# EAGLE schematic 32pins (EAGLE 6.6.0)

## Sheet 1 of 4
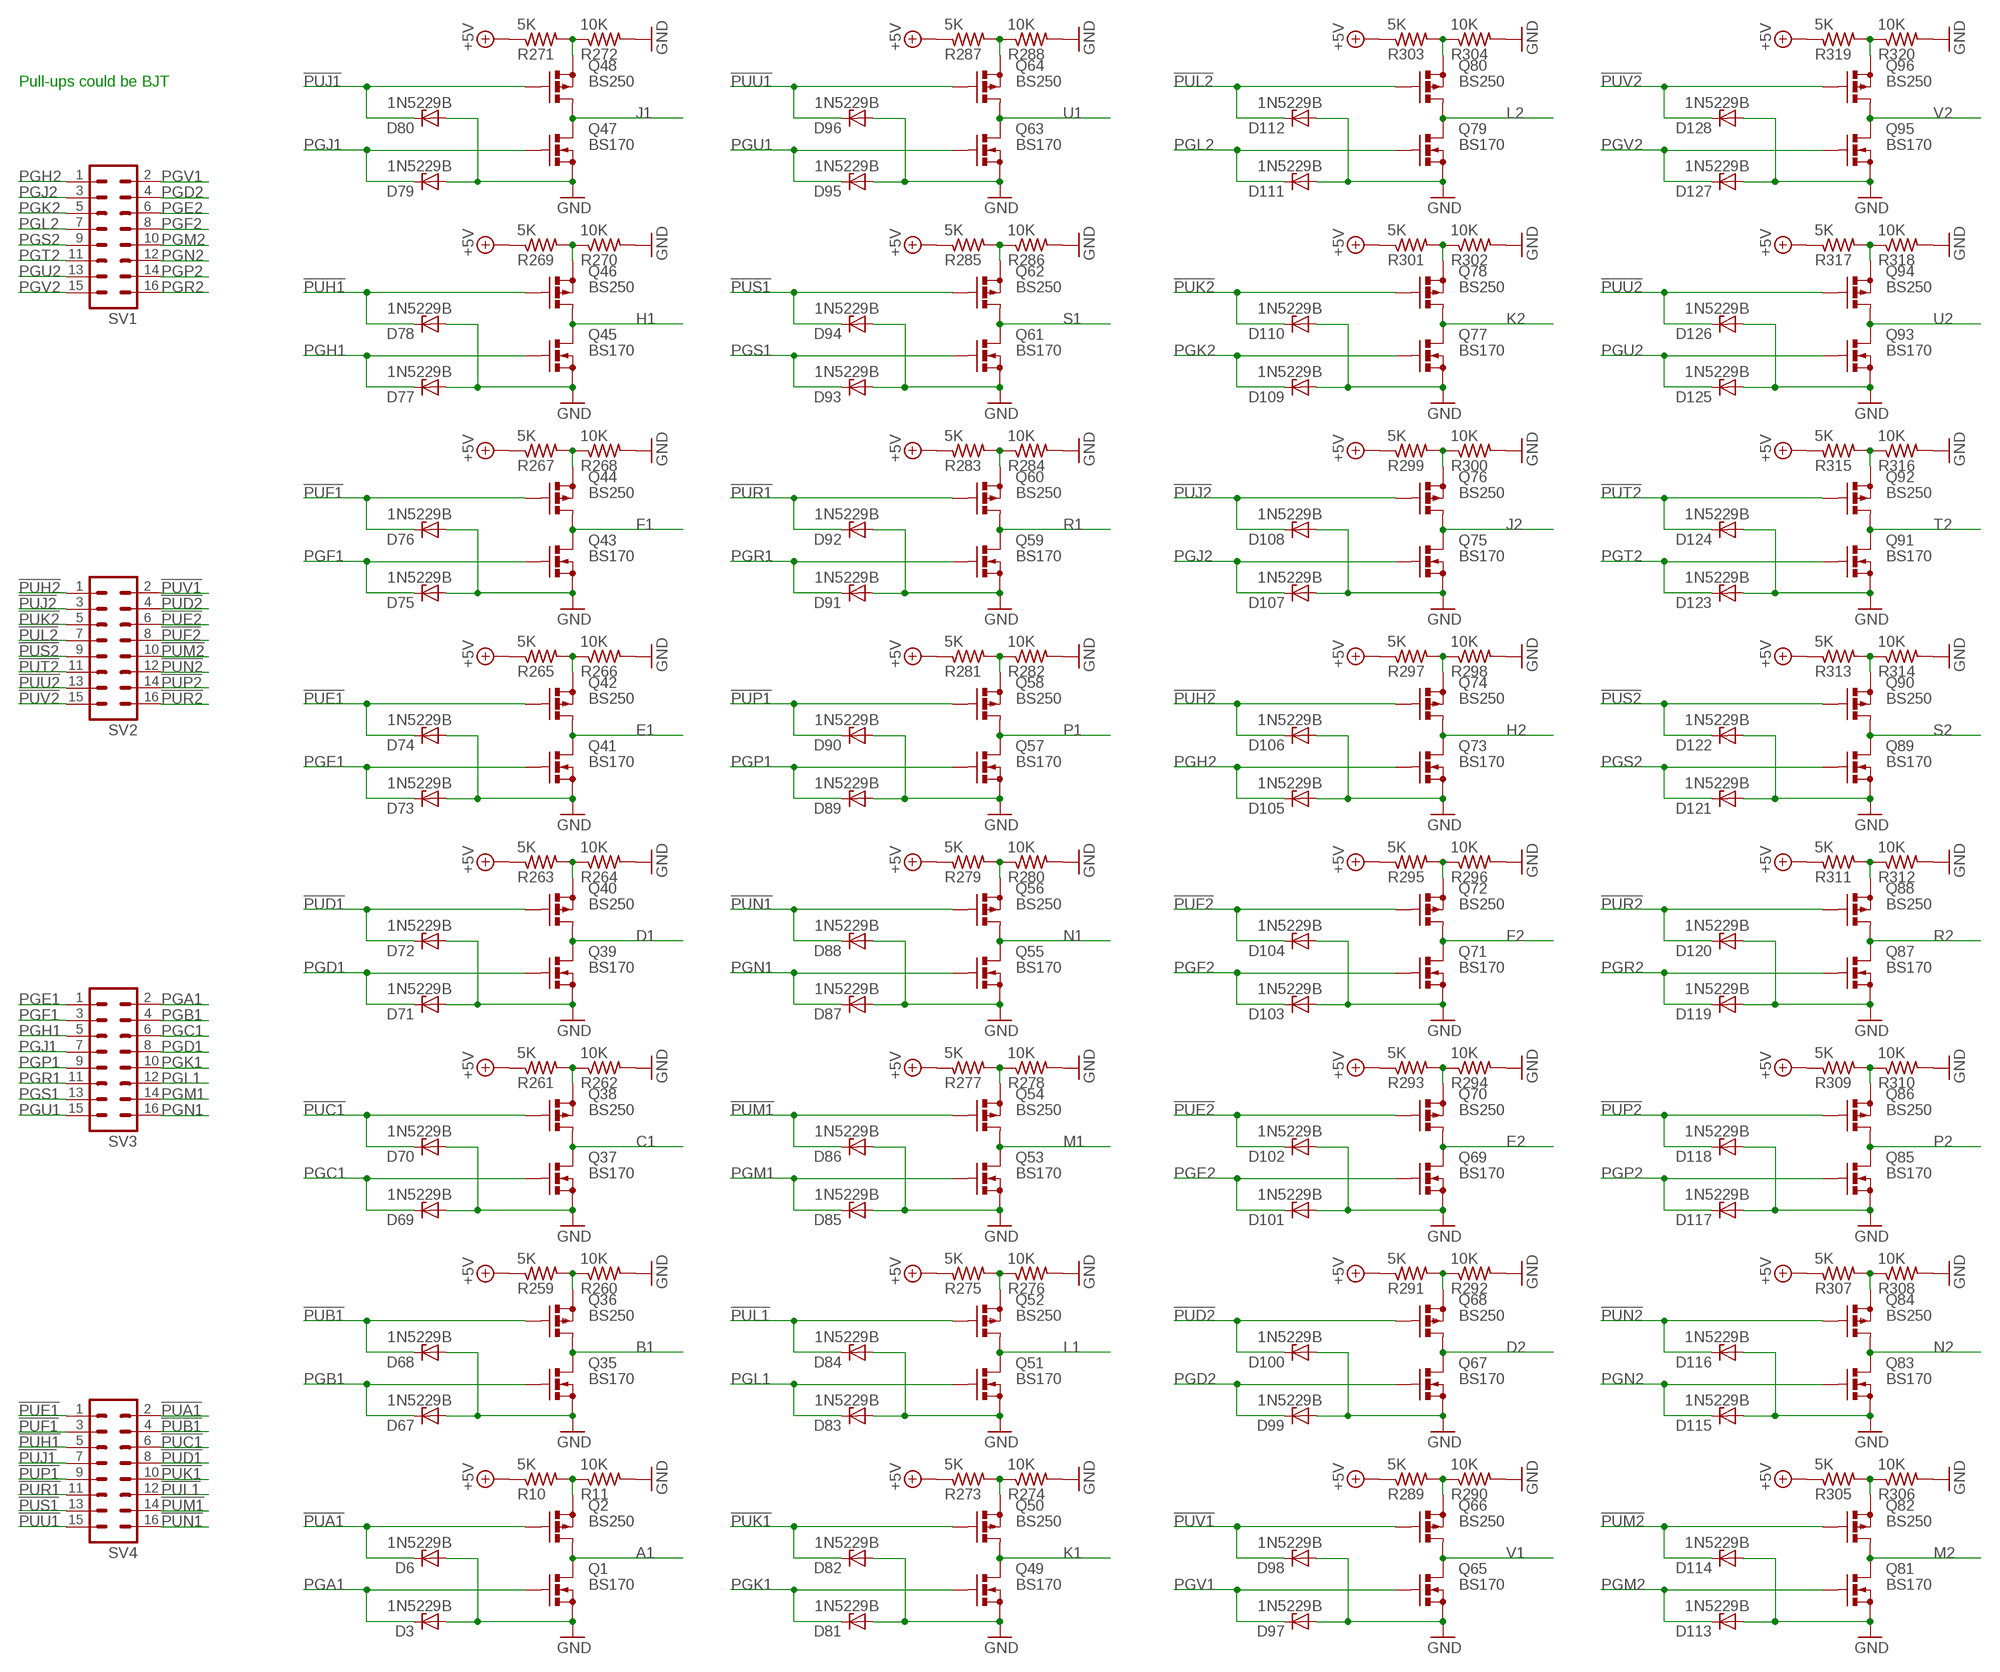
[diagram p0: schematic, sheet 1]

### Parts
D3  1N5229B  ZENER-DIODEZD-2.5  [ZDIO-2.5]
D6  1N5229B  ZENER-DIODEZD-2.5  [ZDIO-2.5]
D67  1N5229B  ZENER-DIODEZD-2.5  [ZDIO-2.5]
D68  1N5229B  ZENER-DIODEZD-2.5  [ZDIO-2.5]
D69  1N5229B  ZENER-DIODEZD-2.5  [ZDIO-2.5]
D70  1N5229B  ZENER-DIODEZD-2.5  [ZDIO-2.5]
D71  1N5229B  ZENER-DIODEZD-2.5  [ZDIO-2.5]
D72  1N5229B  ZENER-DIODEZD-2.5  [ZDIO-2.5]
D73  1N5229B  ZENER-DIODEZD-2.5  [ZDIO-2.5]
D74  1N5229B  ZENER-DIODEZD-2.5  [ZDIO-2.5]
D75  1N5229B  ZENER-DIODEZD-2.5  [ZDIO-2.5]
D76  1N5229B  ZENER-DIODEZD-2.5  [ZDIO-2.5]
D77  1N5229B  ZENER-DIODEZD-2.5  [ZDIO-2.5]
D78  1N5229B  ZENER-DIODEZD-2.5  [ZDIO-2.5]
D79  1N5229B  ZENER-DIODEZD-2.5  [ZDIO-2.5]
D80  1N5229B  ZENER-DIODEZD-2.5  [ZDIO-2.5]
D81  1N5229B  ZENER-DIODEZD-2.5  [ZDIO-2.5]
D82  1N5229B  ZENER-DIODEZD-2.5  [ZDIO-2.5]
D83  1N5229B  ZENER-DIODEZD-2.5  [ZDIO-2.5]
D84  1N5229B  ZENER-DIODEZD-2.5  [ZDIO-2.5]
D85  1N5229B  ZENER-DIODEZD-2.5  [ZDIO-2.5]
D86  1N5229B  ZENER-DIODEZD-2.5  [ZDIO-2.5]
D87  1N5229B  ZENER-DIODEZD-2.5  [ZDIO-2.5]
D88  1N5229B  ZENER-DIODEZD-2.5  [ZDIO-2.5]
D89  1N5229B  ZENER-DIODEZD-2.5  [ZDIO-2.5]
D90  1N5229B  ZENER-DIODEZD-2.5  [ZDIO-2.5]
D91  1N5229B  ZENER-DIODEZD-2.5  [ZDIO-2.5]
D92  1N5229B  ZENER-DIODEZD-2.5  [ZDIO-2.5]
D93  1N5229B  ZENER-DIODEZD-2.5  [ZDIO-2.5]
D94  1N5229B  ZENER-DIODEZD-2.5  [ZDIO-2.5]
D95  1N5229B  ZENER-DIODEZD-2.5  [ZDIO-2.5]
D96  1N5229B  ZENER-DIODEZD-2.5  [ZDIO-2.5]
D97  1N5229B  ZENER-DIODEZD-2.5  [ZDIO-2.5]
D98  1N5229B  ZENER-DIODEZD-2.5  [ZDIO-2.5]
D99  1N5229B  ZENER-DIODEZD-2.5  [ZDIO-2.5]
D100  1N5229B  ZENER-DIODEZD-2.5  [ZDIO-2.5]
D101  1N5229B  ZENER-DIODEZD-2.5  [ZDIO-2.5]
D102  1N5229B  ZENER-DIODEZD-2.5  [ZDIO-2.5]
D103  1N5229B  ZENER-DIODEZD-2.5  [ZDIO-2.5]
D104  1N5229B  ZENER-DIODEZD-2.5  [ZDIO-2.5]
D105  1N5229B  ZENER-DIODEZD-2.5  [ZDIO-2.5]
D106  1N5229B  ZENER-DIODEZD-2.5  [ZDIO-2.5]
D107  1N5229B  ZENER-DIODEZD-2.5  [ZDIO-2.5]
D108  1N5229B  ZENER-DIODEZD-2.5  [ZDIO-2.5]
D109  1N5229B  ZENER-DIODEZD-2.5  [ZDIO-2.5]
D110  1N5229B  ZENER-DIODEZD-2.5  [ZDIO-2.5]
D111  1N5229B  ZENER-DIODEZD-2.5  [ZDIO-2.5]
D112  1N5229B  ZENER-DIODEZD-2.5  [ZDIO-2.5]
D113  1N5229B  ZENER-DIODEZD-2.5  [ZDIO-2.5]
D114  1N5229B  ZENER-DIODEZD-2.5  [ZDIO-2.5]
D115  1N5229B  ZENER-DIODEZD-2.5  [ZDIO-2.5]
D116  1N5229B  ZENER-DIODEZD-2.5  [ZDIO-2.5]
D117  1N5229B  ZENER-DIODEZD-2.5  [ZDIO-2.5]
D118  1N5229B  ZENER-DIODEZD-2.5  [ZDIO-2.5]
D119  1N5229B  ZENER-DIODEZD-2.5  [ZDIO-2.5]
D120  1N5229B  ZENER-DIODEZD-2.5  [ZDIO-2.5]
D121  1N5229B  ZENER-DIODEZD-2.5  [ZDIO-2.5]
D122  1N5229B  ZENER-DIODEZD-2.5  [ZDIO-2.5]
D123  1N5229B  ZENER-DIODEZD-2.5  [ZDIO-2.5]
D124  1N5229B  ZENER-DIODEZD-2.5  [ZDIO-2.5]
D125  1N5229B  ZENER-DIODEZD-2.5  [ZDIO-2.5]
D126  1N5229B  ZENER-DIODEZD-2.5  [ZDIO-2.5]
D127  1N5229B  ZENER-DIODEZD-2.5  [ZDIO-2.5]
D128  1N5229B  ZENER-DIODEZD-2.5  [ZDIO-2.5]
Q1  BS170  [SOT54E]
Q2  BS250  [SOT54E]
Q35  BS170  [SOT54E]
Q36  BS250  [SOT54E]
Q37  BS170  [SOT54E]
Q38  BS250  [SOT54E]
Q39  BS170  [SOT54E]
Q40  BS250  [SOT54E]
Q41  BS170  [SOT54E]
Q42  BS250  [SOT54E]
Q43  BS170  [SOT54E]
Q44  BS250  [SOT54E]
Q45  BS170  [SOT54E]
Q46  BS250  [SOT54E]
Q47  BS170  [SOT54E]
Q48  BS250  [SOT54E]
Q49  BS170  [SOT54E]
Q50  BS250  [SOT54E]
Q51  BS170  [SOT54E]
Q52  BS250  [SOT54E]
Q53  BS170  [SOT54E]
Q54  BS250  [SOT54E]
Q55  BS170  [SOT54E]
Q56  BS250  [SOT54E]
Q57  BS170  [SOT54E]
Q58  BS250  [SOT54E]
Q59  BS170  [SOT54E]
Q60  BS250  [SOT54E]
Q61  BS170  [SOT54E]
Q62  BS250  [SOT54E]
Q63  BS170  [SOT54E]
Q64  BS250  [SOT54E]
Q65  BS170  [SOT54E]
Q66  BS250  [SOT54E]
Q67  BS170  [SOT54E]
Q68  BS250  [SOT54E]
Q69  BS170  [SOT54E]
Q70  BS250  [SOT54E]
Q71  BS170  [SOT54E]
Q72  BS250  [SOT54E]
Q73  BS170  [SOT54E]
Q74  BS250  [SOT54E]
Q75  BS170  [SOT54E]
Q76  BS250  [SOT54E]
Q77  BS170  [SOT54E]
Q78  BS250  [SOT54E]
Q79  BS170  [SOT54E]
Q80  BS250  [SOT54E]
Q81  BS170  [SOT54E]
Q82  BS250  [SOT54E]
Q83  BS170  [SOT54E]
Q84  BS250  [SOT54E]
Q85  BS170  [SOT54E]
Q86  BS250  [SOT54E]
Q87  BS170  [SOT54E]
Q88  BS250  [SOT54E]
Q89  BS170  [SOT54E]
Q90  BS250  [SOT54E]
Q91  BS170  [SOT54E]
Q92  BS250  [SOT54E]
Q93  BS170  [SOT54E]
Q94  BS250  [SOT54E]
Q95  BS170  [SOT54E]
Q96  BS250  [SOT54E]
R10  5K  R-US_0207/2V  [0207/2V]
R11  10K  R-US_0207/2V  [0207/2V]
R259  5K  R-US_0207/2V  [0207/2V]
R260  10K  R-US_0207/2V  [0207/2V]
R261  5K  R-US_0207/2V  [0207/2V]
R262  10K  R-US_0207/2V  [0207/2V]
R263  5K  R-US_0207/2V  [0207/2V]
R264  10K  R-US_0207/2V  [0207/2V]
R265  5K  R-US_0207/2V  [0207/2V]
R266  10K  R-US_0207/2V  [0207/2V]
R267  5K  R-US_0207/2V  [0207/2V]
R268  10K  R-US_0207/2V  [0207/2V]
R269  5K  R-US_0207/2V  [0207/2V]
R270  10K  R-US_0207/2V  [0207/2V]
R271  5K  R-US_0207/2V  [0207/2V]
R272  10K  R-US_0207/2V  [0207/2V]
R273  5K  R-US_0207/2V  [0207/2V]
R274  10K  R-US_0207/2V  [0207/2V]
R275  5K  R-US_0207/2V  [0207/2V]
R276  10K  R-US_0207/2V  [0207/2V]
R277  5K  R-US_0207/2V  [0207/2V]
R278  10K  R-US_0207/2V  [0207/2V]
R279  5K  R-US_0207/2V  [0207/2V]
R280  10K  R-US_0207/2V  [0207/2V]
R281  5K  R-US_0207/2V  [0207/2V]
R282  10K  R-US_0207/2V  [0207/2V]
R283  5K  R-US_0207/2V  [0207/2V]
R284  10K  R-US_0207/2V  [0207/2V]
R285  5K  R-US_0207/2V  [0207/2V]
R286  10K  R-US_0207/2V  [0207/2V]
R287  5K  R-US_0207/2V  [0207/2V]
R288  10K  R-US_0207/2V  [0207/2V]
R289  5K  R-US_0207/2V  [0207/2V]
R290  10K  R-US_0207/2V  [0207/2V]
R291  5K  R-US_0207/2V  [0207/2V]
R292  10K  R-US_0207/2V  [0207/2V]
R293  5K  R-US_0207/2V  [0207/2V]
R294  10K  R-US_0207/2V  [0207/2V]
R295  5K  R-US_0207/2V  [0207/2V]
R296  10K  R-US_0207/2V  [0207/2V]
R297  5K  R-US_0207/2V  [0207/2V]
R298  10K  R-US_0207/2V  [0207/2V]
R299  5K  R-US_0207/2V  [0207/2V]
R300  10K  R-US_0207/2V  [0207/2V]
R301  5K  R-US_0207/2V  [0207/2V]
R302  10K  R-US_0207/2V  [0207/2V]
R303  5K  R-US_0207/2V  [0207/2V]
R304  10K  R-US_0207/2V  [0207/2V]
R305  5K  R-US_0207/2V  [0207/2V]
R306  10K  R-US_0207/2V  [0207/2V]
R307  5K  R-US_0207/2V  [0207/2V]
R308  10K  R-US_0207/2V  [0207/2V]
R309  5K  R-US_0207/2V  [0207/2V]
R310  10K  R-US_0207/2V  [0207/2V]
R311  5K  R-US_0207/2V  [0207/2V]
R312  10K  R-US_0207/2V  [0207/2V]
R313  5K  R-US_0207/2V  [0207/2V]
R314  10K  R-US_0207/2V  [0207/2V]
R315  5K  R-US_0207/2V  [0207/2V]
R316  10K  R-US_0207/2V  [0207/2V]
R317  5K  R-US_0207/2V  [0207/2V]
R318  10K  R-US_0207/2V  [0207/2V]
R319  5K  R-US_0207/2V  [0207/2V]
R320  10K  R-US_0207/2V  [0207/2V]
SV1  MA08-2  [MA08-2]
SV2  MA08-2  [MA08-2]
SV3  MA08-2  [MA08-2]
SV4  MA08-2  [MA08-2]

### Nets
!PUA1: D6.C Q2.G SV4.2
!PUB1: D68.C Q36.G SV4.4
!PUC1: D70.C Q38.G SV4.6
!PUD1: D72.C Q40.G SV4.8
!PUD2: D100.C Q68.G SV2.4
!PUE1: D74.C Q42.G SV4.1
!PUE2: D102.C Q70.G SV2.6
!PUF1: D76.C Q44.G SV4.3
!PUF2: D104.C Q72.G SV2.8
!PUH1: D78.C Q46.G SV4.5
!PUH2: D106.C Q74.G SV2.1
!PUJ1: D80.C Q48.G SV4.7
!PUJ2: D108.C Q76.G SV2.3
!PUK1: D82.C Q50.G SV4.10
!PUK2: D110.C Q78.G SV2.5
!PUL1: D84.C Q52.G SV4.12
!PUL2: D112.C Q80.G SV2.7
!PUM1: D86.C Q54.G SV4.14
!PUM2: D114.C Q82.G SV2.10
!PUN1: D88.C Q56.G SV4.16
!PUN2: D116.C Q84.G SV2.12
!PUP1: D90.C Q58.G SV4.9
!PUP2: D118.C Q86.G SV2.14
!PUR1: D92.C Q60.G SV4.11
!PUR2: D120.C Q88.G SV2.16
!PUS1: D94.C Q62.G SV4.13
!PUS2: D122.C Q90.G SV2.9
!PUT2: D124.C Q92.G SV2.11
!PUU1: D96.C Q64.G SV4.15
!PUU2: D126.C Q94.G SV2.13
!PUV1: D98.C Q66.G SV2.2
!PUV2: D128.C Q96.G SV2.15
+5V: R10.1 R259.1 R261.1 R263.1 R265.1 R267.1 R269.1 R271.1 R273.1 R275.1 R277.1 R279.1 R281.1 R283.1 R285.1 R287.1 R289.1 R291.1 R293.1 R295.1 R297.1 R299.1 R301.1 R303.1 R305.1 R307.1 R309.1 R311.1 R313.1 R315.1 R317.1 R319.1 ; also sheet 4
A1: Q1.D Q2.D ; also sheet 2,3,4
B1: Q35.D Q36.D ; also sheet 2,3,4
C1: Q37.D Q38.D ; also sheet 2,3,4
D1: Q39.D Q40.D ; also sheet 2,3,4
D2: Q67.D Q68.D ; also sheet 2,3,4
E1: Q41.D Q42.D ; also sheet 2,3,4
E2: Q69.D Q70.D ; also sheet 2,3,4
F1: Q43.D Q44.D ; also sheet 2,3,4
F2: Q71.D Q72.D ; also sheet 2,3,4
GND: D3.A D6.A D67.A D68.A D69.A D70.A D71.A D72.A D73.A D74.A D75.A D76.A D77.A D78.A D79.A D80.A D81.A D82.A D83.A D84.A D85.A D86.A D87.A D88.A D89.A D90.A D91.A D92.A D93.A D94.A D95.A D96.A D97.A D98.A D99.A D100.A D101.A D102.A D103.A D104.A D105.A D106.A D107.A D108.A D109.A D110.A D111.A D112.A D113.A D114.A D115.A D116.A D117.A D118.A D119.A D120.A D121.A D122.A D123.A D124.A D125.A D126.A D127.A D128.A Q1.S Q35.S Q37.S Q39.S Q41.S Q43.S Q45.S Q47.S Q49.S Q51.S Q53.S Q55.S Q57.S Q59.S Q61.S Q63.S Q65.S Q67.S Q69.S Q71.S Q73.S Q75.S Q77.S Q79.S Q81.S Q83.S Q85.S Q87.S Q89.S Q91.S Q93.S Q95.S R11.2 R260.2 R262.2 R264.2 R266.2 R268.2 R270.2 R272.2 R274.2 R276.2 R278.2 R280.2 R282.2 R284.2 R286.2 R288.2 R290.2 R292.2 R294.2 R296.2 R298.2 R300.2 R302.2 R304.2 R306.2 R308.2 R310.2 R312.2 R314.2 R316.2 R318.2 R320.2 ; also sheet 2,3,4
H1: Q45.D Q46.D ; also sheet 2,3,4
H2: Q73.D Q74.D ; also sheet 2,3,4
J1: Q47.D Q48.D ; also sheet 2,3,4
J2: Q75.D Q76.D ; also sheet 2,3,4
K1: Q49.D Q50.D ; also sheet 2,3,4
K2: Q77.D Q78.D ; also sheet 2,3,4
L1: Q51.D Q52.D ; also sheet 2,3,4
L2: Q79.D Q80.D ; also sheet 2,3,4
M1: Q53.D Q54.D ; also sheet 2,3,4
M2: Q81.D Q82.D ; also sheet 2,3,4
N1: Q55.D Q56.D ; also sheet 2,3,4
N2: Q83.D Q84.D ; also sheet 2,3,4
N$5: Q2.S R10.2 R11.1
N$294: Q36.S R259.2 R260.1
N$298: Q38.S R261.2 R262.1
N$302: Q40.S R263.2 R264.1
N$306: Q42.S R265.2 R266.1
N$310: Q44.S R267.2 R268.1
N$314: Q46.S R269.2 R270.1
N$318: Q48.S R271.2 R272.1
N$322: Q50.S R273.2 R274.1
N$326: Q52.S R275.2 R276.1
N$330: Q54.S R277.2 R278.1
N$334: Q56.S R279.2 R280.1
N$338: Q58.S R281.2 R282.1
N$342: Q60.S R283.2 R284.1
N$346: Q62.S R285.2 R286.1
N$350: Q64.S R287.2 R288.1
N$354: Q66.S R289.2 R290.1
N$358: Q68.S R291.2 R292.1
N$362: Q70.S R293.2 R294.1
N$366: Q72.S R295.2 R296.1
N$370: Q74.S R297.2 R298.1
N$374: Q76.S R299.2 R300.1
N$378: Q78.S R301.2 R302.1
N$382: Q80.S R303.2 R304.1
N$386: Q82.S R305.2 R306.1
N$390: Q84.S R307.2 R308.1
N$394: Q86.S R309.2 R310.1
N$398: Q88.S R311.2 R312.1
N$402: Q90.S R313.2 R314.1
N$406: Q92.S R315.2 R316.1
N$410: Q94.S R317.2 R318.1
N$414: Q96.S R319.2 R320.1
P1: Q57.D Q58.D ; also sheet 2,3,4
P2: Q85.D Q86.D ; also sheet 2,3,4
PGA1: D3.C Q1.G SV3.2
PGB1: D67.C Q35.G SV3.4
PGC1: D69.C Q37.G SV3.6
PGD1: D71.C Q39.G SV3.8
PGD2: D99.C Q67.G SV1.4
PGE1: D73.C Q41.G SV3.1
PGE2: D101.C Q69.G SV1.6
PGF1: D75.C Q43.G SV3.3
PGF2: D103.C Q71.G SV1.8
PGH1: D77.C Q45.G SV3.5
PGH2: D105.C Q73.G SV1.1
PGJ1: D79.C Q47.G SV3.7
PGJ2: D107.C Q75.G SV1.3
PGK1: D81.C Q49.G SV3.10
PGK2: D109.C Q77.G SV1.5
PGL1: D83.C Q51.G SV3.12
PGL2: D111.C Q79.G SV1.7
PGM1: D85.C Q53.G SV3.14
PGM2: D113.C Q81.G SV1.10
PGN1: D87.C Q55.G SV3.16
PGN2: D115.C Q83.G SV1.12
PGP1: D89.C Q57.G SV3.9
PGP2: D117.C Q85.G SV1.14
PGR1: D91.C Q59.G SV3.11
PGR2: D119.C Q87.G SV1.16
PGS1: D93.C Q61.G SV3.13
PGS2: D121.C Q89.G SV1.9
PGT2: D123.C Q91.G SV1.11
PGU1: D95.C Q63.G SV3.15
PGU2: D125.C Q93.G SV1.13
PGV1: D97.C Q65.G SV1.2
PGV2: D127.C Q95.G SV1.15
R1: Q59.D Q60.D ; also sheet 2,3,4
R2: Q87.D Q88.D ; also sheet 2,3,4
S1: Q61.D Q62.D ; also sheet 2,3,4
S2: Q89.D Q90.D ; also sheet 2,3,4
T2: Q91.D Q92.D ; also sheet 2,3,4
U1: Q63.D Q64.D ; also sheet 2,3,4
U2: Q93.D Q94.D ; also sheet 2,3,4
V1: Q65.D Q66.D ; also sheet 2,3,4
V2: Q95.D Q96.D ; also sheet 2,3,4

### Notes on the sheet
- Pull-ups could be BJT

## Sheet 2 of 4
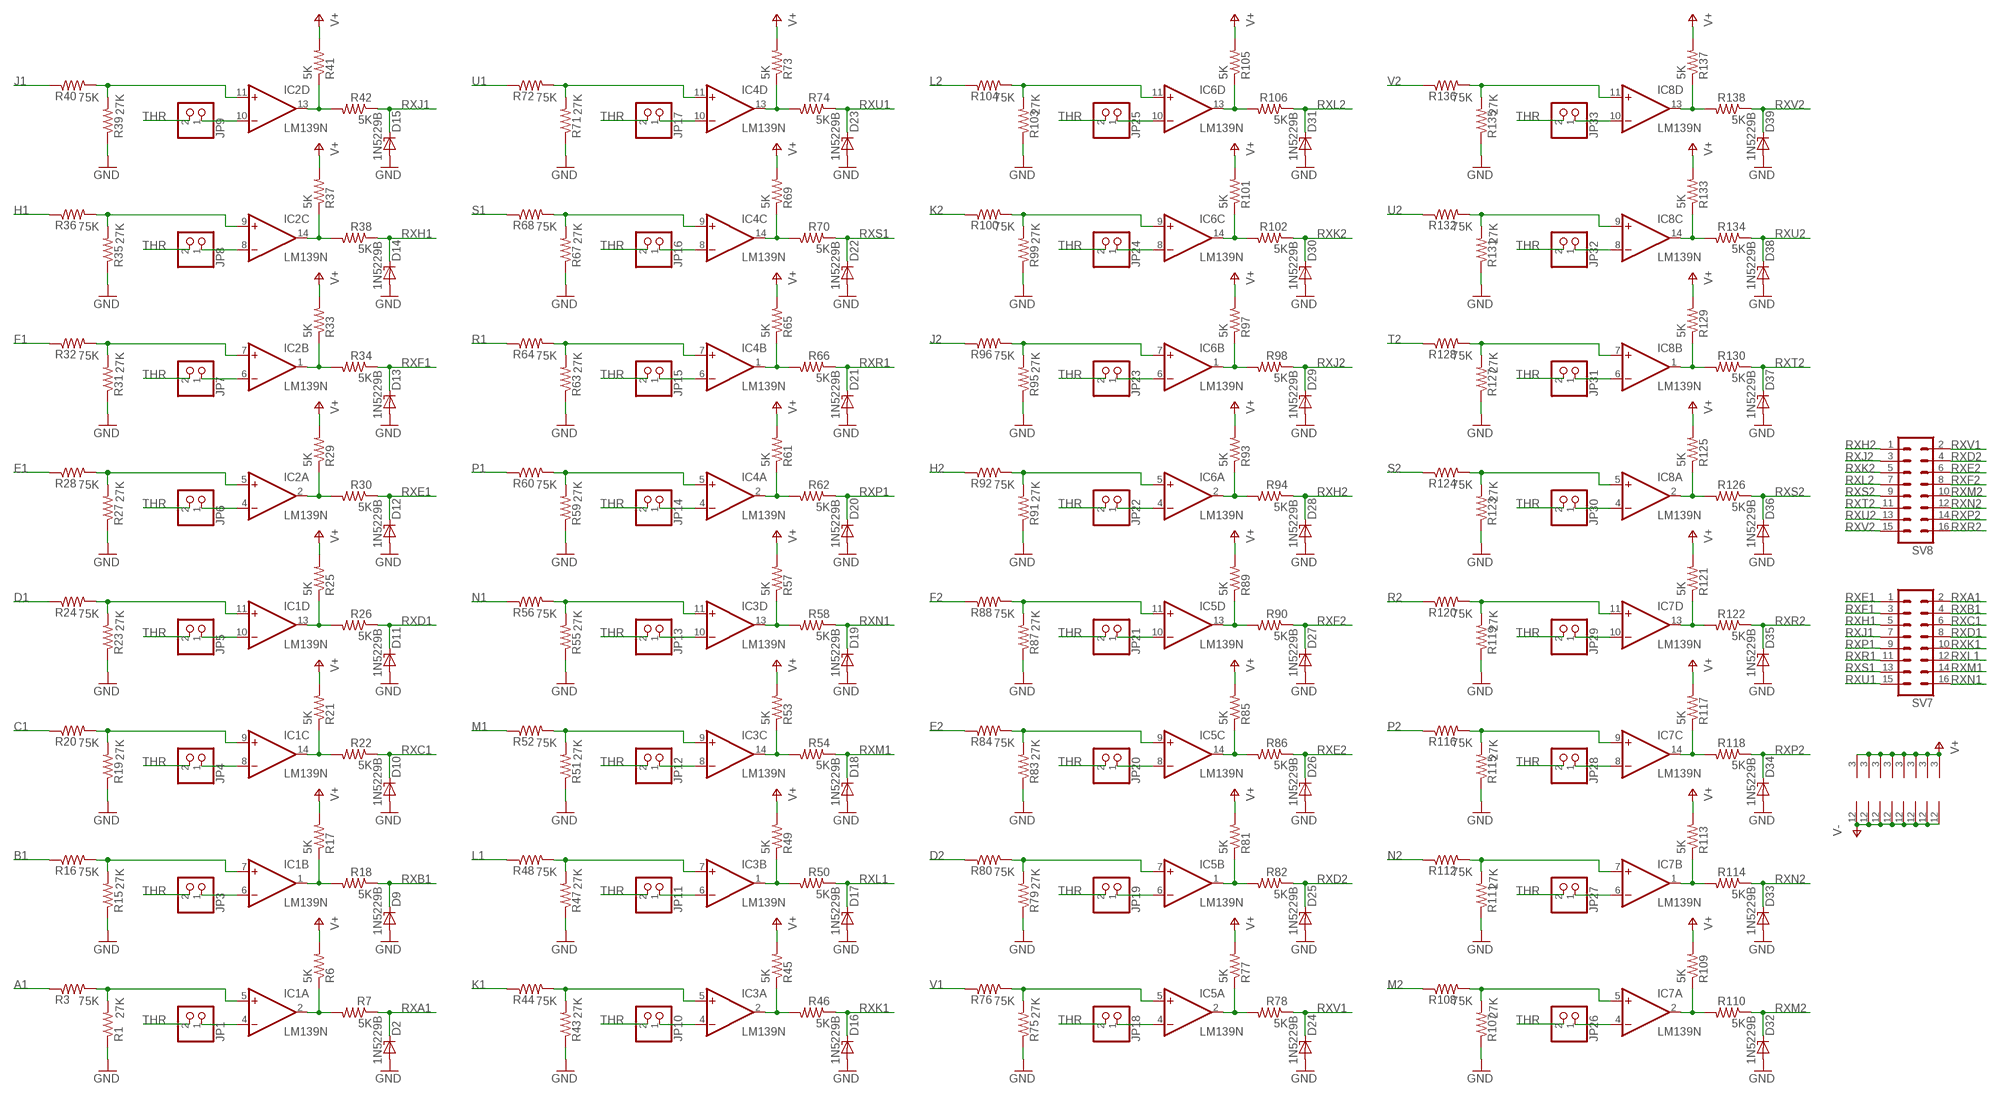
[diagram p1: schematic, sheet 2]

### Parts
D2  1N5229B  ZENER-DIODEZD-2.5  [ZDIO-2.5]
D9  1N5229B  ZENER-DIODEZD-2.5  [ZDIO-2.5]
D10  1N5229B  ZENER-DIODEZD-2.5  [ZDIO-2.5]
D11  1N5229B  ZENER-DIODEZD-2.5  [ZDIO-2.5]
D12  1N5229B  ZENER-DIODEZD-2.5  [ZDIO-2.5]
D13  1N5229B  ZENER-DIODEZD-2.5  [ZDIO-2.5]
D14  1N5229B  ZENER-DIODEZD-2.5  [ZDIO-2.5]
D15  1N5229B  ZENER-DIODEZD-2.5  [ZDIO-2.5]
D16  1N5229B  ZENER-DIODEZD-2.5  [ZDIO-2.5]
D17  1N5229B  ZENER-DIODEZD-2.5  [ZDIO-2.5]
D18  1N5229B  ZENER-DIODEZD-2.5  [ZDIO-2.5]
D19  1N5229B  ZENER-DIODEZD-2.5  [ZDIO-2.5]
D20  1N5229B  ZENER-DIODEZD-2.5  [ZDIO-2.5]
D21  1N5229B  ZENER-DIODEZD-2.5  [ZDIO-2.5]
D22  1N5229B  ZENER-DIODEZD-2.5  [ZDIO-2.5]
D23  1N5229B  ZENER-DIODEZD-2.5  [ZDIO-2.5]
D24  1N5229B  ZENER-DIODEZD-2.5  [ZDIO-2.5]
D25  1N5229B  ZENER-DIODEZD-2.5  [ZDIO-2.5]
D26  1N5229B  ZENER-DIODEZD-2.5  [ZDIO-2.5]
D27  1N5229B  ZENER-DIODEZD-2.5  [ZDIO-2.5]
D28  1N5229B  ZENER-DIODEZD-2.5  [ZDIO-2.5]
D29  1N5229B  ZENER-DIODEZD-2.5  [ZDIO-2.5]
D30  1N5229B  ZENER-DIODEZD-2.5  [ZDIO-2.5]
D31  1N5229B  ZENER-DIODEZD-2.5  [ZDIO-2.5]
D32  1N5229B  ZENER-DIODEZD-2.5  [ZDIO-2.5]
D33  1N5229B  ZENER-DIODEZD-2.5  [ZDIO-2.5]
D34  1N5229B  ZENER-DIODEZD-2.5  [ZDIO-2.5]
D35  1N5229B  ZENER-DIODEZD-2.5  [ZDIO-2.5]
D36  1N5229B  ZENER-DIODEZD-2.5  [ZDIO-2.5]
D37  1N5229B  ZENER-DIODEZD-2.5  [ZDIO-2.5]
D38  1N5229B  ZENER-DIODEZD-2.5  [ZDIO-2.5]
D39  1N5229B  ZENER-DIODEZD-2.5  [ZDIO-2.5]
IC1  LM139N  LM339N  [DIL14]
IC2  LM139N  LM339N  [DIL14]
IC3  LM139N  LM339N  [DIL14]
IC4  LM139N  LM339N  [DIL14]
IC5  LM139N  LM339N  [DIL14]
IC6  LM139N  LM339N  [DIL14]
IC7  LM139N  LM339N  [DIL14]
IC8  LM139N  LM339N  [DIL14]
JP1  PINHD-1X2  [1X02]
JP3  PINHD-1X2  [1X02]
JP4  PINHD-1X2  [1X02]
JP5  PINHD-1X2  [1X02]
JP6  PINHD-1X2  [1X02]
JP7  PINHD-1X2  [1X02]
JP8  PINHD-1X2  [1X02]
JP9  PINHD-1X2  [1X02]
JP10  PINHD-1X2  [1X02]
JP11  PINHD-1X2  [1X02]
JP12  PINHD-1X2  [1X02]
JP13  PINHD-1X2  [1X02]
JP14  PINHD-1X2  [1X02]
JP15  PINHD-1X2  [1X02]
JP16  PINHD-1X2  [1X02]
JP17  PINHD-1X2  [1X02]
JP18  PINHD-1X2  [1X02]
JP19  PINHD-1X2  [1X02]
JP20  PINHD-1X2  [1X02]
JP21  PINHD-1X2  [1X02]
JP22  PINHD-1X2  [1X02]
JP23  PINHD-1X2  [1X02]
JP24  PINHD-1X2  [1X02]
JP25  PINHD-1X2  [1X02]
JP26  PINHD-1X2  [1X02]
JP27  PINHD-1X2  [1X02]
JP28  PINHD-1X2  [1X02]
JP29  PINHD-1X2  [1X02]
JP30  PINHD-1X2  [1X02]
JP31  PINHD-1X2  [1X02]
JP32  PINHD-1X2  [1X02]
JP33  PINHD-1X2  [1X02]
R1  27K  R-US_0207/2V  [0207/2V]
R3  75K  R-US_0207/2V  [0207/2V]
R6  5K  R-US_0207/2V  [0207/2V]
R7  5K  R-US_0207/2V  [0207/2V]
R15  27K  R-US_0207/2V  [0207/2V]
R16  75K  R-US_0207/2V  [0207/2V]
R17  5K  R-US_0207/2V  [0207/2V]
R18  5K  R-US_0207/2V  [0207/2V]
R19  27K  R-US_0207/2V  [0207/2V]
R20  75K  R-US_0207/2V  [0207/2V]
R21  5K  R-US_0207/2V  [0207/2V]
R22  5K  R-US_0207/2V  [0207/2V]
R23  27K  R-US_0207/2V  [0207/2V]
R24  75K  R-US_0207/2V  [0207/2V]
R25  5K  R-US_0207/2V  [0207/2V]
R26  5K  R-US_0207/2V  [0207/2V]
R27  27K  R-US_0207/2V  [0207/2V]
R28  75K  R-US_0207/2V  [0207/2V]
R29  5K  R-US_0207/2V  [0207/2V]
R30  5K  R-US_0207/2V  [0207/2V]
R31  27K  R-US_0207/2V  [0207/2V]
R32  75K  R-US_0207/2V  [0207/2V]
R33  5K  R-US_0207/2V  [0207/2V]
R34  5K  R-US_0207/2V  [0207/2V]
R35  27K  R-US_0207/2V  [0207/2V]
R36  75K  R-US_0207/2V  [0207/2V]
R37  5K  R-US_0207/2V  [0207/2V]
R38  5K  R-US_0207/2V  [0207/2V]
R39  27K  R-US_0207/2V  [0207/2V]
R40  75K  R-US_0207/2V  [0207/2V]
R41  5K  R-US_0207/2V  [0207/2V]
R42  5K  R-US_0207/2V  [0207/2V]
R43  27K  R-US_0207/2V  [0207/2V]
R44  75K  R-US_0207/2V  [0207/2V]
R45  5K  R-US_0207/2V  [0207/2V]
R46  5K  R-US_0207/2V  [0207/2V]
R47  27K  R-US_0207/2V  [0207/2V]
R48  75K  R-US_0207/2V  [0207/2V]
R49  5K  R-US_0207/2V  [0207/2V]
R50  5K  R-US_0207/2V  [0207/2V]
R51  27K  R-US_0207/2V  [0207/2V]
R52  75K  R-US_0207/2V  [0207/2V]
R53  5K  R-US_0207/2V  [0207/2V]
R54  5K  R-US_0207/2V  [0207/2V]
R55  27K  R-US_0207/2V  [0207/2V]
R56  75K  R-US_0207/2V  [0207/2V]
R57  5K  R-US_0207/2V  [0207/2V]
R58  5K  R-US_0207/2V  [0207/2V]
R59  27K  R-US_0207/2V  [0207/2V]
R60  75K  R-US_0207/2V  [0207/2V]
R61  5K  R-US_0207/2V  [0207/2V]
R62  5K  R-US_0207/2V  [0207/2V]
R63  27K  R-US_0207/2V  [0207/2V]
R64  75K  R-US_0207/2V  [0207/2V]
R65  5K  R-US_0207/2V  [0207/2V]
R66  5K  R-US_0207/2V  [0207/2V]
R67  27K  R-US_0207/2V  [0207/2V]
R68  75K  R-US_0207/2V  [0207/2V]
R69  5K  R-US_0207/2V  [0207/2V]
R70  5K  R-US_0207/2V  [0207/2V]
R71  27K  R-US_0207/2V  [0207/2V]
R72  75K  R-US_0207/2V  [0207/2V]
R73  5K  R-US_0207/2V  [0207/2V]
R74  5K  R-US_0207/2V  [0207/2V]
R75  27K  R-US_0207/2V  [0207/2V]
R76  75K  R-US_0207/2V  [0207/2V]
R77  5K  R-US_0207/2V  [0207/2V]
R78  5K  R-US_0207/2V  [0207/2V]
R79  27K  R-US_0207/2V  [0207/2V]
R80  75K  R-US_0207/2V  [0207/2V]
R81  5K  R-US_0207/2V  [0207/2V]
R82  5K  R-US_0207/2V  [0207/2V]
R83  27K  R-US_0207/2V  [0207/2V]
R84  75K  R-US_0207/2V  [0207/2V]
R85  5K  R-US_0207/2V  [0207/2V]
R86  5K  R-US_0207/2V  [0207/2V]
R87  27K  R-US_0207/2V  [0207/2V]
R88  75K  R-US_0207/2V  [0207/2V]
R89  5K  R-US_0207/2V  [0207/2V]
R90  5K  R-US_0207/2V  [0207/2V]
R91  27K  R-US_0207/2V  [0207/2V]
R92  75K  R-US_0207/2V  [0207/2V]
R93  5K  R-US_0207/2V  [0207/2V]
R94  5K  R-US_0207/2V  [0207/2V]
R95  27K  R-US_0207/2V  [0207/2V]
R96  75K  R-US_0207/2V  [0207/2V]
R97  5K  R-US_0207/2V  [0207/2V]
R98  5K  R-US_0207/2V  [0207/2V]
R99  27K  R-US_0207/2V  [0207/2V]
R100  75K  R-US_0207/2V  [0207/2V]
R101  5K  R-US_0207/2V  [0207/2V]
R102  5K  R-US_0207/2V  [0207/2V]
R103  27K  R-US_0207/2V  [0207/2V]
R104  75K  R-US_0207/2V  [0207/2V]
R105  5K  R-US_0207/2V  [0207/2V]
R106  5K  R-US_0207/2V  [0207/2V]
R107  27K  R-US_0207/2V  [0207/2V]
R108  75K  R-US_0207/2V  [0207/2V]
R109  5K  R-US_0207/2V  [0207/2V]
R110  5K  R-US_0207/2V  [0207/2V]
R111  27K  R-US_0207/2V  [0207/2V]
R112  75K  R-US_0207/2V  [0207/2V]
R113  5K  R-US_0207/2V  [0207/2V]
R114  5K  R-US_0207/2V  [0207/2V]
R115  27K  R-US_0207/2V  [0207/2V]
R116  75K  R-US_0207/2V  [0207/2V]
R117  5K  R-US_0207/2V  [0207/2V]
R118  5K  R-US_0207/2V  [0207/2V]
R119  27K  R-US_0207/2V  [0207/2V]
R120  75K  R-US_0207/2V  [0207/2V]
R121  5K  R-US_0207/2V  [0207/2V]
R122  5K  R-US_0207/2V  [0207/2V]
R123  27K  R-US_0207/2V  [0207/2V]
R124  75K  R-US_0207/2V  [0207/2V]
R125  5K  R-US_0207/2V  [0207/2V]
R126  5K  R-US_0207/2V  [0207/2V]
R127  27K  R-US_0207/2V  [0207/2V]
R128  75K  R-US_0207/2V  [0207/2V]
R129  5K  R-US_0207/2V  [0207/2V]
R130  5K  R-US_0207/2V  [0207/2V]
R131  27K  R-US_0207/2V  [0207/2V]
R132  75K  R-US_0207/2V  [0207/2V]
R133  5K  R-US_0207/2V  [0207/2V]
R134  5K  R-US_0207/2V  [0207/2V]
R135  27K  R-US_0207/2V  [0207/2V]
R136  75K  R-US_0207/2V  [0207/2V]
R137  5K  R-US_0207/2V  [0207/2V]
R138  5K  R-US_0207/2V  [0207/2V]
SV7  MA08-2  [MA08-2]
SV8  MA08-2  [MA08-2]

### Nets
A1: R3.1 ; also sheet 1,3,4
B1: R16.1 ; also sheet 1,3,4
C1: R20.1 ; also sheet 1,3,4
D1: R24.1 ; also sheet 1,3,4
D2: R80.1 ; also sheet 1,3,4
E1: R28.1 ; also sheet 1,3,4
E2: R84.1 ; also sheet 1,3,4
F1: R32.1 ; also sheet 1,3,4
F2: R88.1 ; also sheet 1,3,4
GND: D2.A D9.A D10.A D11.A D12.A D13.A D14.A D15.A D16.A D17.A D18.A D19.A D20.A D21.A D22.A D23.A D24.A D25.A D26.A D27.A D28.A D29.A D30.A D31.A D32.A D33.A D34.A D35.A D36.A D37.A D38.A D39.A R1.1 R15.1 R19.1 R23.1 R27.1 R31.1 R35.1 R39.1 R43.1 R47.1 R51.1 R55.1 R59.1 R63.1 R67.1 R71.1 R75.1 R79.1 R83.1 R87.1 R91.1 R95.1 R99.1 R103.1 R107.1 R111.1 R115.1 R119.1 R123.1 R127.1 R131.1 R135.1 ; also sheet 1,3,4
H1: R36.1 ; also sheet 1,3,4
H2: R92.1 ; also sheet 1,3,4
J1: R40.1 ; also sheet 1,3,4
J2: R96.1 ; also sheet 1,3,4
K1: R44.1 ; also sheet 1,3,4
K2: R100.1 ; also sheet 1,3,4
L1: R48.1 ; also sheet 1,3,4
L2: R104.1 ; also sheet 1,3,4
M1: R52.1 ; also sheet 1,3,4
M2: R108.1 ; also sheet 1,3,4
N1: R56.1 ; also sheet 1,3,4
N2: R112.1 ; also sheet 1,3,4
N$13: IC1.5(A:+IN) R1.2 R3.2
N$14: IC1.4(A:-IN) JP1.1
N$18: IC1.2(A:OUT) R6.1 R7.2
N$20: IC1.7(B:+IN) R15.2 R16.2
N$21: IC1.6(B:-IN) JP3.1
N$22: IC1.1(B:OUT) R17.1 R18.2
N$23: IC1.9(C:+IN) R19.2 R20.2
N$24: IC1.8(C:-IN) JP4.1
N$25: IC1.14(C:OUT) R21.1 R22.2
N$26: IC1.11(D:+IN) R23.2 R24.2
N$27: IC1.10(D:-IN) JP5.1
N$28: IC1.13(D:OUT) R25.1 R26.2
N$35: IC2.5(A:+IN) R27.2 R28.2
N$36: IC2.4(A:-IN) JP6.1
N$38: IC2.2(A:OUT) R29.1 R30.2
N$39: IC2.7(B:+IN) R31.2 R32.2
N$40: IC2.6(B:-IN) JP7.1
N$41: IC2.1(B:OUT) R33.1 R34.2
N$42: IC2.9(C:+IN) R35.2 R36.2
N$43: IC2.8(C:-IN) JP8.1
N$44: IC2.14(C:OUT) R37.1 R38.2
N$45: IC2.11(D:+IN) R39.2 R40.2
N$46: IC2.10(D:-IN) JP9.1
N$47: IC2.13(D:OUT) R41.1 R42.2
N$55: IC3.5(A:+IN) R43.2 R44.2
N$56: IC3.4(A:-IN) JP10.1
N$58: IC3.2(A:OUT) R45.1 R46.2
N$59: IC3.7(B:+IN) R47.2 R48.2
N$60: IC3.6(B:-IN) JP11.1
N$61: IC3.1(B:OUT) R49.1 R50.2
N$62: IC3.9(C:+IN) R51.2 R52.2
N$63: IC3.8(C:-IN) JP12.1
N$64: IC3.14(C:OUT) R53.1 R54.2
N$65: IC3.11(D:+IN) R55.2 R56.2
N$66: IC3.10(D:-IN) JP13.1
N$67: IC3.13(D:OUT) R57.1 R58.2
N$75: IC4.5(A:+IN) R59.2 R60.2
N$76: IC4.4(A:-IN) JP14.1
N$78: IC4.2(A:OUT) R61.1 R62.2
N$79: IC4.7(B:+IN) R63.2 R64.2
N$80: IC4.6(B:-IN) JP15.1
N$81: IC4.1(B:OUT) R65.1 R66.2
N$82: IC4.9(C:+IN) R67.2 R68.2
N$83: IC4.8(C:-IN) JP16.1
N$84: IC4.14(C:OUT) R69.1 R70.2
N$85: IC4.11(D:+IN) R71.2 R72.2
N$86: IC4.10(D:-IN) JP17.1
N$87: IC4.13(D:OUT) R73.1 R74.2
N$95: IC5.5(A:+IN) R75.2 R76.2
N$96: IC5.4(A:-IN) JP18.1
N$98: IC5.2(A:OUT) R77.1 R78.2
N$99: IC5.7(B:+IN) R79.2 R80.2
N$100: IC5.6(B:-IN) JP19.1
N$101: IC5.1(B:OUT) R81.1 R82.2
N$102: IC5.9(C:+IN) R83.2 R84.2
N$103: IC5.8(C:-IN) JP20.1
N$104: IC5.14(C:OUT) R85.1 R86.2
N$105: IC5.11(D:+IN) R87.2 R88.2
N$106: IC5.10(D:-IN) JP21.1
N$107: IC5.13(D:OUT) R89.1 R90.2
N$115: IC6.5(A:+IN) R91.2 R92.2
N$116: IC6.4(A:-IN) JP22.1
N$118: IC6.2(A:OUT) R93.1 R94.2
N$119: IC6.7(B:+IN) R95.2 R96.2
N$120: IC6.6(B:-IN) JP23.1
N$121: IC6.1(B:OUT) R97.1 R98.2
N$122: IC6.9(C:+IN) R99.2 R100.2
N$123: IC6.8(C:-IN) JP24.1
N$124: IC6.14(C:OUT) R101.1 R102.2
N$125: IC6.11(D:+IN) R103.2 R104.2
N$126: IC6.10(D:-IN) JP25.1
N$127: IC6.13(D:OUT) R105.1 R106.2
N$135: IC7.5(A:+IN) R107.2 R108.2
N$136: IC7.4(A:-IN) JP26.1
N$138: IC7.2(A:OUT) R109.1 R110.2
N$139: IC7.7(B:+IN) R111.2 R112.2
N$140: IC7.6(B:-IN) JP27.1
N$141: IC7.1(B:OUT) R113.1 R114.2
N$142: IC7.9(C:+IN) R115.2 R116.2
N$143: IC7.8(C:-IN) JP28.1
N$144: IC7.14(C:OUT) R117.1 R118.2
N$145: IC7.11(D:+IN) R119.2 R120.2
N$146: IC7.10(D:-IN) JP29.1
N$147: IC7.13(D:OUT) R121.1 R122.2
N$155: IC8.5(A:+IN) R123.2 R124.2
N$156: IC8.4(A:-IN) JP30.1
N$158: IC8.2(A:OUT) R125.1 R126.2
N$159: IC8.7(B:+IN) R127.2 R128.2
N$160: IC8.6(B:-IN) JP31.1
N$161: IC8.1(B:OUT) R129.1 R130.2
N$162: IC8.9(C:+IN) R131.2 R132.2
N$163: IC8.8(C:-IN) JP32.1
N$164: IC8.14(C:OUT) R133.1 R134.2
N$165: IC8.11(D:+IN) R135.2 R136.2
N$166: IC8.10(D:-IN) JP33.1
N$167: IC8.13(D:OUT) R137.1 R138.2
P1: R60.1 ; also sheet 1,3,4
P2: R116.1 ; also sheet 1,3,4
R1: R64.1 ; also sheet 1,3,4
R2: R120.1 ; also sheet 1,3,4
RXA1: D2.C R7.1 SV7.2
RXB1: D9.C R18.1 SV7.4
RXC1: D10.C R22.1 SV7.6
RXD1: D11.C R26.1 SV7.8
RXD2: D25.C R82.1 SV8.4
RXE1: D12.C R30.1 SV7.1
RXE2: D26.C R86.1 SV8.6
RXF1: D13.C R34.1 SV7.3
RXF2: D27.C R90.1 SV8.8
RXH1: D14.C R38.1 SV7.5
RXH2: D28.C R94.1 SV8.1
RXJ1: D15.C R42.1 SV7.7
RXJ2: D29.C R98.1 SV8.3
RXK1: D16.C R46.1 SV7.10
RXK2: D30.C R102.1 SV8.5
RXL1: D17.C R50.1 SV7.12
RXL2: D31.C R106.1 SV8.7
RXM1: D18.C R54.1 SV7.14
RXM2: D32.C R110.1 SV8.10
RXN1: D19.C R58.1 SV7.16
RXN2: D33.C R114.1 SV8.12
RXP1: D20.C R62.1 SV7.9
RXP2: D34.C R118.1 SV8.14
RXR1: D21.C R66.1 SV7.11
RXR2: D35.C R122.1 SV8.16
RXS1: D22.C R70.1 SV7.13
RXS2: D36.C R126.1 SV8.9
RXT2: D37.C R130.1 SV8.11
RXU1: D23.C R74.1 SV7.15
RXU2: D38.C R134.1 SV8.13
RXV1: D24.C R78.1 SV8.2
RXV2: D39.C R138.1 SV8.15
S1: R68.1 ; also sheet 1,3,4
S2: R124.1 ; also sheet 1,3,4
T2: R128.1 ; also sheet 1,3,4
THR: JP1.2 JP3.2 JP4.2 JP5.2 JP6.2 JP7.2 JP8.2 JP9.2 JP10.2 JP11.2 JP12.2 JP13.2 JP14.2 JP15.2 JP16.2 JP17.2 JP18.2 JP19.2 JP20.2 JP21.2 JP22.2 JP23.2 JP24.2 JP25.2 JP26.2 JP27.2 JP28.2 JP29.2 JP30.2 JP31.2 JP32.2 JP33.2 ; also sheet 4
U1: R72.1 ; also sheet 1,3,4
U2: R132.1 ; also sheet 1,3,4
V1: R76.1 ; also sheet 1,3,4
V2: R136.1 ; also sheet 1,3,4
V+: IC1.3(P:V+) IC2.3(P:V+) IC3.3(P:V+) IC4.3(P:V+) IC5.3(P:V+) IC6.3(P:V+) IC7.3(P:V+) IC8.3(P:V+) R6.2 R17.2 R21.2 R25.2 R29.2 R33.2 R37.2 R41.2 R45.2 R49.2 R53.2 R57.2 R61.2 R65.2 R69.2 R73.2 R77.2 R81.2 R85.2 R89.2 R93.2 R97.2 R101.2 R105.2 R109.2 R113.2 R117.2 R121.2 R125.2 R129.2 R133.2 R137.2 ; also sheet 4
V-: IC1.12(P:GND) IC2.12(P:GND) IC3.12(P:GND) IC4.12(P:GND) IC5.12(P:GND) IC6.12(P:GND) IC7.12(P:GND) IC8.12(P:GND) ; also sheet 4

## Sheet 3 of 4
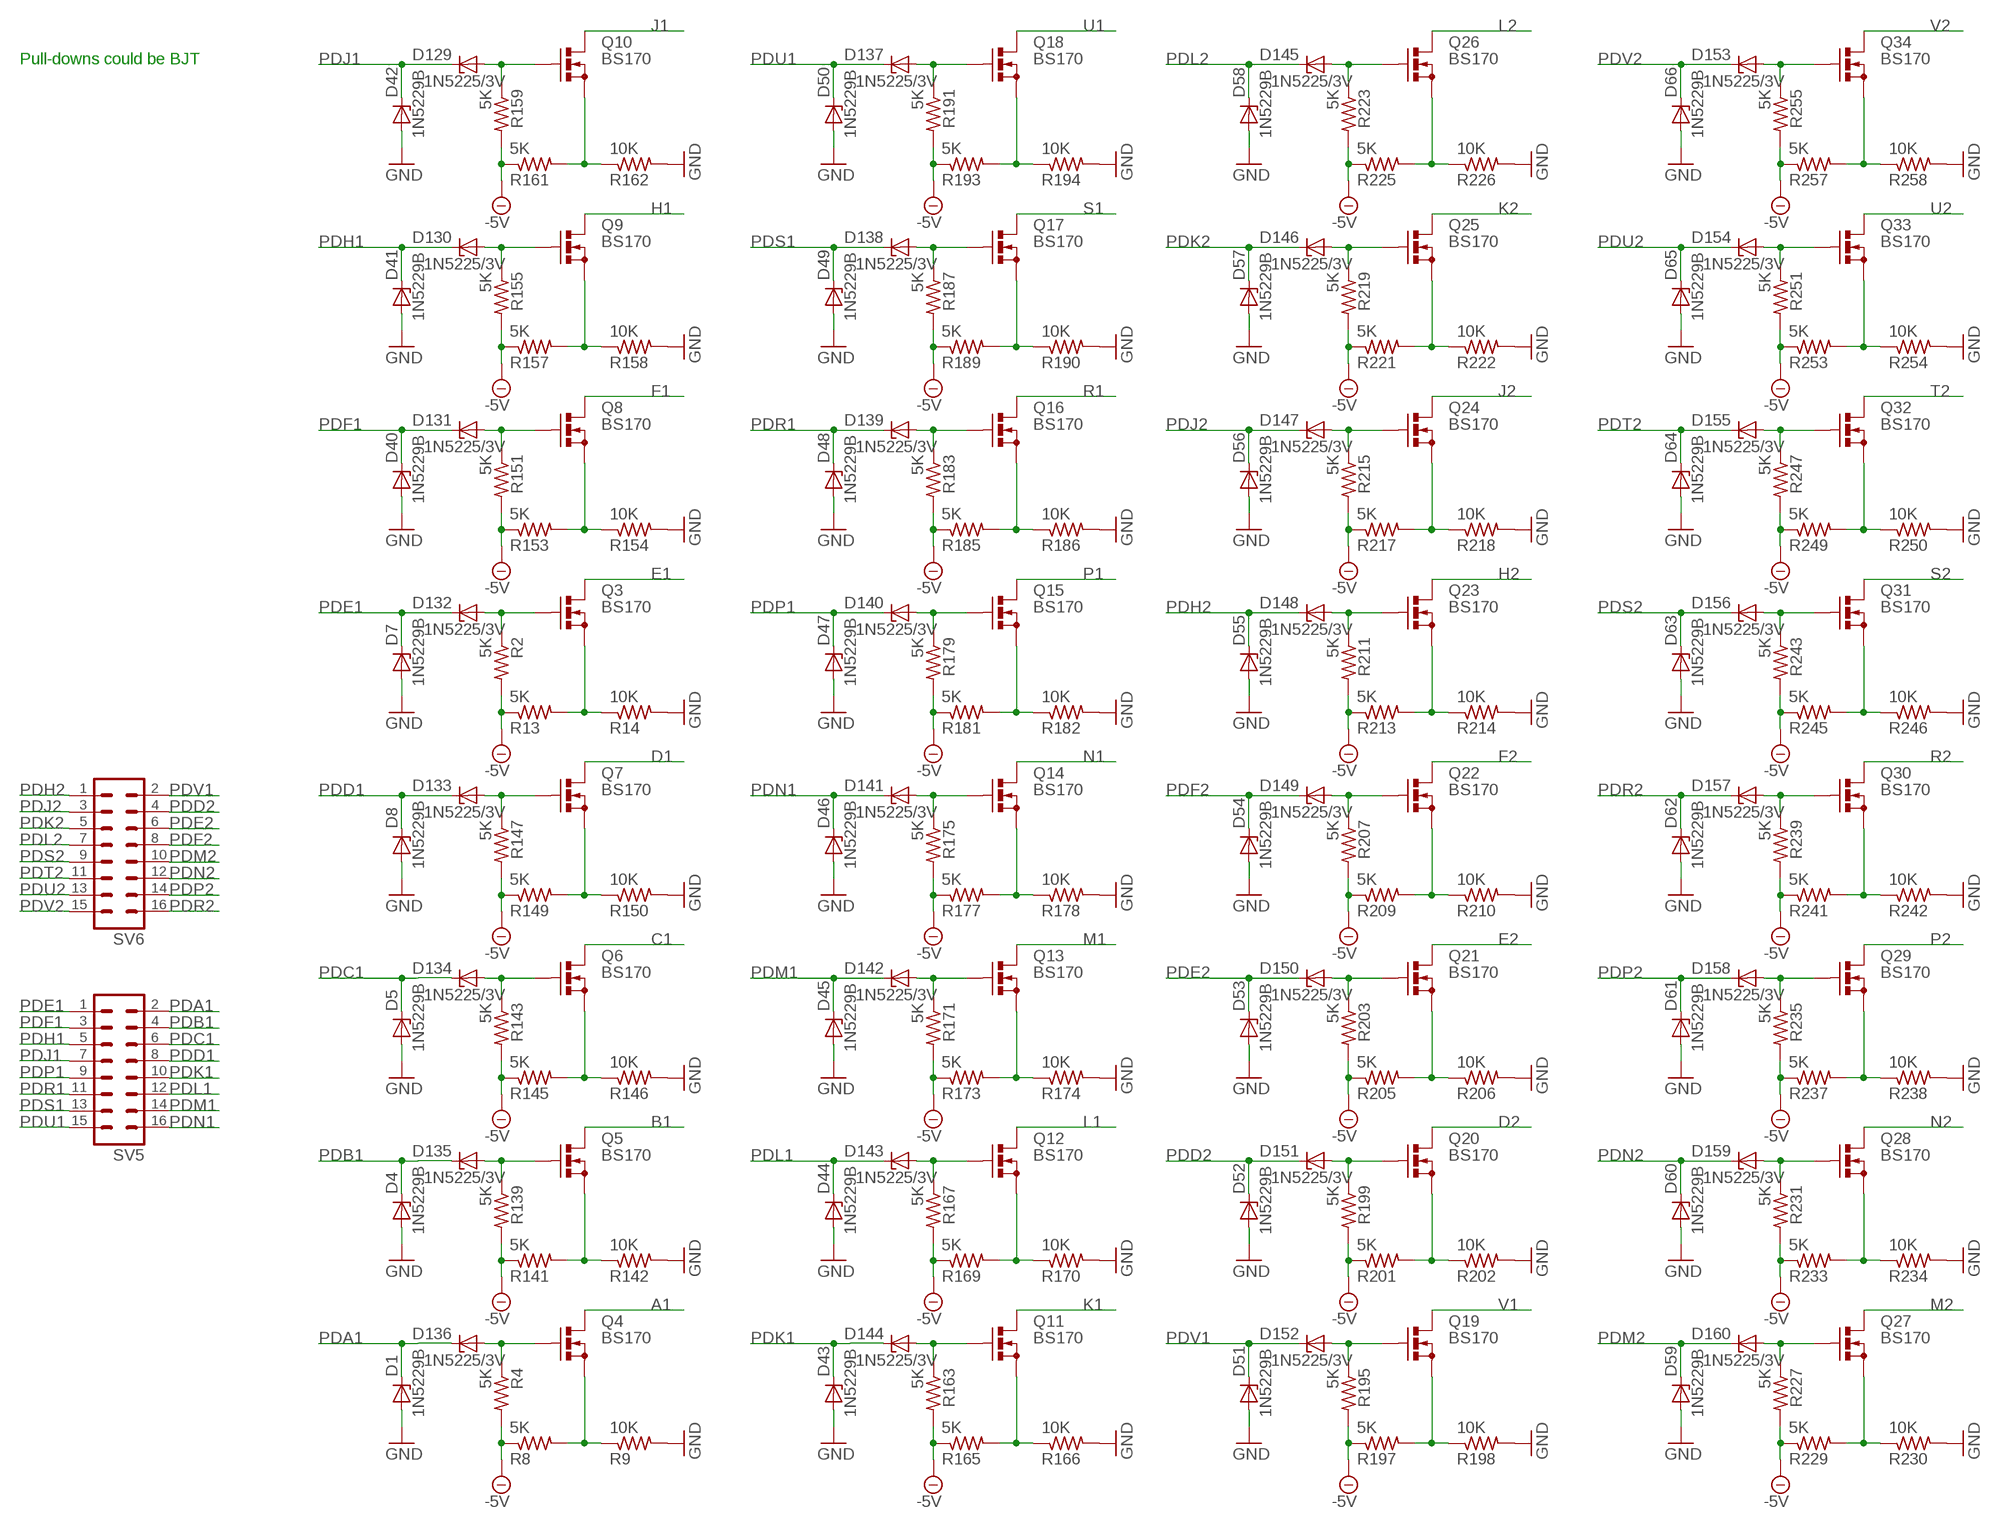
[diagram p2: schematic, sheet 3]

### Parts
D1  1N5229B  ZENER-DIODEZD-2.5  [ZDIO-2.5]
D4  1N5229B  ZENER-DIODEZD-2.5  [ZDIO-2.5]
D5  1N5229B  ZENER-DIODEZD-2.5  [ZDIO-2.5]
D7  1N5229B  ZENER-DIODEZD-2.5  [ZDIO-2.5]
D8  1N5229B  ZENER-DIODEZD-2.5  [ZDIO-2.5]
D40  1N5229B  ZENER-DIODEZD-2.5  [ZDIO-2.5]
D41  1N5229B  ZENER-DIODEZD-2.5  [ZDIO-2.5]
D42  1N5229B  ZENER-DIODEZD-2.5  [ZDIO-2.5]
D43  1N5229B  ZENER-DIODEZD-2.5  [ZDIO-2.5]
D44  1N5229B  ZENER-DIODEZD-2.5  [ZDIO-2.5]
D45  1N5229B  ZENER-DIODEZD-2.5  [ZDIO-2.5]
D46  1N5229B  ZENER-DIODEZD-2.5  [ZDIO-2.5]
D47  1N5229B  ZENER-DIODEZD-2.5  [ZDIO-2.5]
D48  1N5229B  ZENER-DIODEZD-2.5  [ZDIO-2.5]
D49  1N5229B  ZENER-DIODEZD-2.5  [ZDIO-2.5]
D50  1N5229B  ZENER-DIODEZD-2.5  [ZDIO-2.5]
D51  1N5229B  ZENER-DIODEZD-2.5  [ZDIO-2.5]
D52  1N5229B  ZENER-DIODEZD-2.5  [ZDIO-2.5]
D53  1N5229B  ZENER-DIODEZD-2.5  [ZDIO-2.5]
D54  1N5229B  ZENER-DIODEZD-2.5  [ZDIO-2.5]
D55  1N5229B  ZENER-DIODEZD-2.5  [ZDIO-2.5]
D56  1N5229B  ZENER-DIODEZD-2.5  [ZDIO-2.5]
D57  1N5229B  ZENER-DIODEZD-2.5  [ZDIO-2.5]
D58  1N5229B  ZENER-DIODEZD-2.5  [ZDIO-2.5]
D59  1N5229B  ZENER-DIODEZD-2.5  [ZDIO-2.5]
D60  1N5229B  ZENER-DIODEZD-2.5  [ZDIO-2.5]
D61  1N5229B  ZENER-DIODEZD-2.5  [ZDIO-2.5]
D62  1N5229B  ZENER-DIODEZD-2.5  [ZDIO-2.5]
D63  1N5229B  ZENER-DIODEZD-2.5  [ZDIO-2.5]
D64  1N5229B  ZENER-DIODEZD-2.5  [ZDIO-2.5]
D65  1N5229B  ZENER-DIODEZD-2.5  [ZDIO-2.5]
D66  1N5229B  ZENER-DIODEZD-2.5  [ZDIO-2.5]
D129  1N5225/3V  ZENER-DIODEZD-2.5  [ZDIO-2.5]
D130  1N5225/3V  ZENER-DIODEZD-2.5  [ZDIO-2.5]
D131  1N5225/3V  ZENER-DIODEZD-2.5  [ZDIO-2.5]
D132  1N5225/3V  ZENER-DIODEZD-2.5  [ZDIO-2.5]
D133  1N5225/3V  ZENER-DIODEZD-2.5  [ZDIO-2.5]
D134  1N5225/3V  ZENER-DIODEZD-2.5  [ZDIO-2.5]
D135  1N5225/3V  ZENER-DIODEZD-2.5  [ZDIO-2.5]
D136  1N5225/3V  ZENER-DIODEZD-2.5  [ZDIO-2.5]
D137  1N5225/3V  ZENER-DIODEZD-2.5  [ZDIO-2.5]
D138  1N5225/3V  ZENER-DIODEZD-2.5  [ZDIO-2.5]
D139  1N5225/3V  ZENER-DIODEZD-2.5  [ZDIO-2.5]
D140  1N5225/3V  ZENER-DIODEZD-2.5  [ZDIO-2.5]
D141  1N5225/3V  ZENER-DIODEZD-2.5  [ZDIO-2.5]
D142  1N5225/3V  ZENER-DIODEZD-2.5  [ZDIO-2.5]
D143  1N5225/3V  ZENER-DIODEZD-2.5  [ZDIO-2.5]
D144  1N5225/3V  ZENER-DIODEZD-2.5  [ZDIO-2.5]
D145  1N5225/3V  ZENER-DIODEZD-2.5  [ZDIO-2.5]
D146  1N5225/3V  ZENER-DIODEZD-2.5  [ZDIO-2.5]
D147  1N5225/3V  ZENER-DIODEZD-2.5  [ZDIO-2.5]
D148  1N5225/3V  ZENER-DIODEZD-2.5  [ZDIO-2.5]
D149  1N5225/3V  ZENER-DIODEZD-2.5  [ZDIO-2.5]
D150  1N5225/3V  ZENER-DIODEZD-2.5  [ZDIO-2.5]
D151  1N5225/3V  ZENER-DIODEZD-2.5  [ZDIO-2.5]
D152  1N5225/3V  ZENER-DIODEZD-2.5  [ZDIO-2.5]
D153  1N5225/3V  ZENER-DIODEZD-2.5  [ZDIO-2.5]
D154  1N5225/3V  ZENER-DIODEZD-2.5  [ZDIO-2.5]
D155  1N5225/3V  ZENER-DIODEZD-2.5  [ZDIO-2.5]
D156  1N5225/3V  ZENER-DIODEZD-2.5  [ZDIO-2.5]
D157  1N5225/3V  ZENER-DIODEZD-2.5  [ZDIO-2.5]
D158  1N5225/3V  ZENER-DIODEZD-2.5  [ZDIO-2.5]
D159  1N5225/3V  ZENER-DIODEZD-2.5  [ZDIO-2.5]
D160  1N5225/3V  ZENER-DIODEZD-2.5  [ZDIO-2.5]
Q3  BS170  [SOT54E]
Q4  BS170  [SOT54E]
Q5  BS170  [SOT54E]
Q6  BS170  [SOT54E]
Q7  BS170  [SOT54E]
Q8  BS170  [SOT54E]
Q9  BS170  [SOT54E]
Q10  BS170  [SOT54E]
Q11  BS170  [SOT54E]
Q12  BS170  [SOT54E]
Q13  BS170  [SOT54E]
Q14  BS170  [SOT54E]
Q15  BS170  [SOT54E]
Q16  BS170  [SOT54E]
Q17  BS170  [SOT54E]
Q18  BS170  [SOT54E]
Q19  BS170  [SOT54E]
Q20  BS170  [SOT54E]
Q21  BS170  [SOT54E]
Q22  BS170  [SOT54E]
Q23  BS170  [SOT54E]
Q24  BS170  [SOT54E]
Q25  BS170  [SOT54E]
Q26  BS170  [SOT54E]
Q27  BS170  [SOT54E]
Q28  BS170  [SOT54E]
Q29  BS170  [SOT54E]
Q30  BS170  [SOT54E]
Q31  BS170  [SOT54E]
Q32  BS170  [SOT54E]
Q33  BS170  [SOT54E]
Q34  BS170  [SOT54E]
R2  5K  R-US_0207/2V  [0207/2V]
R4  5K  R-US_0207/2V  [0207/2V]
R8  5K  R-US_0207/2V  [0207/2V]
R9  10K  R-US_0207/2V  [0207/2V]
R13  5K  R-US_0207/2V  [0207/2V]
R14  10K  R-US_0207/2V  [0207/2V]
R139  5K  R-US_0207/2V  [0207/2V]
R141  5K  R-US_0207/2V  [0207/2V]
R142  10K  R-US_0207/2V  [0207/2V]
R143  5K  R-US_0207/2V  [0207/2V]
R145  5K  R-US_0207/2V  [0207/2V]
R146  10K  R-US_0207/2V  [0207/2V]
R147  5K  R-US_0207/2V  [0207/2V]
R149  5K  R-US_0207/2V  [0207/2V]
R150  10K  R-US_0207/2V  [0207/2V]
R151  5K  R-US_0207/2V  [0207/2V]
R153  5K  R-US_0207/2V  [0207/2V]
R154  10K  R-US_0207/2V  [0207/2V]
R155  5K  R-US_0207/2V  [0207/2V]
R157  5K  R-US_0207/2V  [0207/2V]
R158  10K  R-US_0207/2V  [0207/2V]
R159  5K  R-US_0207/2V  [0207/2V]
R161  5K  R-US_0207/2V  [0207/2V]
R162  10K  R-US_0207/2V  [0207/2V]
R163  5K  R-US_0207/2V  [0207/2V]
R165  5K  R-US_0207/2V  [0207/2V]
R166  10K  R-US_0207/2V  [0207/2V]
R167  5K  R-US_0207/2V  [0207/2V]
R169  5K  R-US_0207/2V  [0207/2V]
R170  10K  R-US_0207/2V  [0207/2V]
R171  5K  R-US_0207/2V  [0207/2V]
R173  5K  R-US_0207/2V  [0207/2V]
R174  10K  R-US_0207/2V  [0207/2V]
R175  5K  R-US_0207/2V  [0207/2V]
R177  5K  R-US_0207/2V  [0207/2V]
R178  10K  R-US_0207/2V  [0207/2V]
R179  5K  R-US_0207/2V  [0207/2V]
R181  5K  R-US_0207/2V  [0207/2V]
R182  10K  R-US_0207/2V  [0207/2V]
R183  5K  R-US_0207/2V  [0207/2V]
R185  5K  R-US_0207/2V  [0207/2V]
R186  10K  R-US_0207/2V  [0207/2V]
R187  5K  R-US_0207/2V  [0207/2V]
R189  5K  R-US_0207/2V  [0207/2V]
R190  10K  R-US_0207/2V  [0207/2V]
R191  5K  R-US_0207/2V  [0207/2V]
R193  5K  R-US_0207/2V  [0207/2V]
R194  10K  R-US_0207/2V  [0207/2V]
R195  5K  R-US_0207/2V  [0207/2V]
R197  5K  R-US_0207/2V  [0207/2V]
R198  10K  R-US_0207/2V  [0207/2V]
R199  5K  R-US_0207/2V  [0207/2V]
R201  5K  R-US_0207/2V  [0207/2V]
R202  10K  R-US_0207/2V  [0207/2V]
R203  5K  R-US_0207/2V  [0207/2V]
R205  5K  R-US_0207/2V  [0207/2V]
R206  10K  R-US_0207/2V  [0207/2V]
R207  5K  R-US_0207/2V  [0207/2V]
R209  5K  R-US_0207/2V  [0207/2V]
R210  10K  R-US_0207/2V  [0207/2V]
R211  5K  R-US_0207/2V  [0207/2V]
R213  5K  R-US_0207/2V  [0207/2V]
R214  10K  R-US_0207/2V  [0207/2V]
R215  5K  R-US_0207/2V  [0207/2V]
R217  5K  R-US_0207/2V  [0207/2V]
R218  10K  R-US_0207/2V  [0207/2V]
R219  5K  R-US_0207/2V  [0207/2V]
R221  5K  R-US_0207/2V  [0207/2V]
R222  10K  R-US_0207/2V  [0207/2V]
R223  5K  R-US_0207/2V  [0207/2V]
R225  5K  R-US_0207/2V  [0207/2V]
R226  10K  R-US_0207/2V  [0207/2V]
R227  5K  R-US_0207/2V  [0207/2V]
R229  5K  R-US_0207/2V  [0207/2V]
R230  10K  R-US_0207/2V  [0207/2V]
R231  5K  R-US_0207/2V  [0207/2V]
R233  5K  R-US_0207/2V  [0207/2V]
R234  10K  R-US_0207/2V  [0207/2V]
R235  5K  R-US_0207/2V  [0207/2V]
R237  5K  R-US_0207/2V  [0207/2V]
R238  10K  R-US_0207/2V  [0207/2V]
R239  5K  R-US_0207/2V  [0207/2V]
R241  5K  R-US_0207/2V  [0207/2V]
R242  10K  R-US_0207/2V  [0207/2V]
R243  5K  R-US_0207/2V  [0207/2V]
R245  5K  R-US_0207/2V  [0207/2V]
R246  10K  R-US_0207/2V  [0207/2V]
R247  5K  R-US_0207/2V  [0207/2V]
R249  5K  R-US_0207/2V  [0207/2V]
R250  10K  R-US_0207/2V  [0207/2V]
R251  5K  R-US_0207/2V  [0207/2V]
R253  5K  R-US_0207/2V  [0207/2V]
R254  10K  R-US_0207/2V  [0207/2V]
R255  5K  R-US_0207/2V  [0207/2V]
R257  5K  R-US_0207/2V  [0207/2V]
R258  10K  R-US_0207/2V  [0207/2V]
SV5  MA08-2  [MA08-2]
SV6  MA08-2  [MA08-2]

### Nets
-5V: R2.2 R4.2 R8.1 R13.1 R139.2 R141.1 R143.2 R145.1 R147.2 R149.1 R151.2 R153.1 R155.2 R157.1 R159.2 R161.1 R163.2 R165.1 R167.2 R169.1 R171.2 R173.1 R175.2 R177.1 R179.2 R181.1 R183.2 R185.1 R187.2 R189.1 R191.2 R193.1 R195.2 R197.1 R199.2 R201.1 R203.2 R205.1 R207.2 R209.1 R211.2 R213.1 R215.2 R217.1 R219.2 R221.1 R223.2 R225.1 R227.2 R229.1 R231.2 R233.1 R235.2 R237.1 R239.2 R241.1 R243.2 R245.1 R247.2 R249.1 R251.2 R253.1 R255.2 R257.1 ; also sheet 4
A1: Q4.D ; also sheet 1,2,4
B1: Q5.D ; also sheet 1,2,4
C1: Q6.D ; also sheet 1,2,4
D1: Q7.D ; also sheet 1,2,4
D2: Q20.D ; also sheet 1,2,4
E1: Q3.D ; also sheet 1,2,4
E2: Q21.D ; also sheet 1,2,4
F1: Q8.D ; also sheet 1,2,4
F2: Q22.D ; also sheet 1,2,4
GND: D1.A D4.A D5.A D7.A D8.A D40.A D41.A D42.A D43.A D44.A D45.A D46.A D47.A D48.A D49.A D50.A D51.A D52.A D53.A D54.A D55.A D56.A D57.A D58.A D59.A D60.A D61.A D62.A D63.A D64.A D65.A D66.A R9.2 R14.2 R142.2 R146.2 R150.2 R154.2 R158.2 R162.2 R166.2 R170.2 R174.2 R178.2 R182.2 R186.2 R190.2 R194.2 R198.2 R202.2 R206.2 R210.2 R214.2 R218.2 R222.2 R226.2 R230.2 R234.2 R238.2 R242.2 R246.2 R250.2 R254.2 R258.2 ; also sheet 1,2,4
H1: Q9.D ; also sheet 1,2,4
H2: Q23.D ; also sheet 1,2,4
J1: Q10.D ; also sheet 1,2,4
J2: Q24.D ; also sheet 1,2,4
K1: Q11.D ; also sheet 1,2,4
K2: Q25.D ; also sheet 1,2,4
L1: Q12.D ; also sheet 1,2,4
L2: Q26.D ; also sheet 1,2,4
M1: Q13.D ; also sheet 1,2,4
M2: Q27.D ; also sheet 1,2,4
N1: Q14.D ; also sheet 1,2,4
N2: Q28.D ; also sheet 1,2,4
N$4: D132.A Q3.G R2.1
N$7: D136.A Q4.G R4.1
N$8: Q4.S R8.2 R9.1
N$12: D135.A Q5.G R139.1
N$15: Q5.S R141.2 R142.1
N$16: Q3.S R13.2 R14.1
N$177: D134.A Q6.G R143.1
N$178: Q6.S R145.2 R146.1
N$181: D133.A Q7.G R147.1
N$182: Q7.S R149.2 R150.1
N$186: D131.A Q8.G R151.1
N$187: Q8.S R153.2 R154.1
N$190: D130.A Q9.G R155.1
N$191: Q9.S R157.2 R158.1
N$194: D129.A Q10.G R159.1
N$195: Q10.S R161.2 R162.1
N$198: D144.A Q11.G R163.1
N$199: Q11.S R165.2 R166.1
N$202: D143.A Q12.G R167.1
N$203: Q12.S R169.2 R170.1
N$206: D142.A Q13.G R171.1
N$207: Q13.S R173.2 R174.1
N$210: D141.A Q14.G R175.1
N$211: Q14.S R177.2 R178.1
N$214: D140.A Q15.G R179.1
N$215: Q15.S R181.2 R182.1
N$218: D139.A Q16.G R183.1
N$219: Q16.S R185.2 R186.1
N$222: D138.A Q17.G R187.1
N$223: Q17.S R189.2 R190.1
N$226: D137.A Q18.G R191.1
N$227: Q18.S R193.2 R194.1
N$230: D152.A Q19.G R195.1
N$231: Q19.S R197.2 R198.1
N$234: D151.A Q20.G R199.1
N$235: Q20.S R201.2 R202.1
N$238: D150.A Q21.G R203.1
N$239: Q21.S R205.2 R206.1
N$242: D149.A Q22.G R207.1
N$243: Q22.S R209.2 R210.1
N$246: D148.A Q23.G R211.1
N$247: Q23.S R213.2 R214.1
N$250: D147.A Q24.G R215.1
N$251: Q24.S R217.2 R218.1
N$254: D146.A Q25.G R219.1
N$255: Q25.S R221.2 R222.1
N$258: D145.A Q26.G R223.1
N$259: Q26.S R225.2 R226.1
N$262: D160.A Q27.G R227.1
N$263: Q27.S R229.2 R230.1
N$266: D159.A Q28.G R231.1
N$267: Q28.S R233.2 R234.1
N$270: D158.A Q29.G R235.1
N$271: Q29.S R237.2 R238.1
N$274: D157.A Q30.G R239.1
N$275: Q30.S R241.2 R242.1
N$278: D156.A Q31.G R243.1
N$279: Q31.S R245.2 R246.1
N$282: D155.A Q32.G R247.1
N$283: Q32.S R249.2 R250.1
N$286: D154.A Q33.G R251.1
N$287: Q33.S R253.2 R254.1
N$290: D153.A Q34.G R255.1
N$291: Q34.S R257.2 R258.1
P1: Q15.D ; also sheet 1,2,4
P2: Q29.D ; also sheet 1,2,4
PDA1: D1.C D136.C SV5.2
PDB1: D4.C D135.C SV5.4
PDC1: D5.C D134.C SV5.6
PDD1: D8.C D133.C SV5.8
PDD2: D52.C D151.C SV6.4
PDE1: D7.C D132.C SV5.1
PDE2: D53.C D150.C SV6.6
PDF1: D40.C D131.C SV5.3
PDF2: D54.C D149.C SV6.8
PDH1: D41.C D130.C SV5.5
PDH2: D55.C D148.C SV6.1
PDJ1: D42.C D129.C SV5.7
PDJ2: D56.C D147.C SV6.3
PDK1: D43.C D144.C SV5.10
PDK2: D57.C D146.C SV6.5
PDL1: D44.C D143.C SV5.12
PDL2: D58.C D145.C SV6.7
PDM1: D45.C D142.C SV5.14
PDM2: D59.C D160.C SV6.10
PDN1: D46.C D141.C SV5.16
PDN2: D60.C D159.C SV6.12
PDP1: D47.C D140.C SV5.9
PDP2: D61.C D158.C SV6.14
PDR1: D48.C D139.C SV5.11
PDR2: D62.C D157.C SV6.16
PDS1: D49.C D138.C SV5.13
PDS2: D63.C D156.C SV6.9
PDT2: D64.C D155.C SV6.11
PDU1: D50.C D137.C SV5.15
PDU2: D65.C D154.C SV6.13
PDV1: D51.C D152.C SV6.2
PDV2: D66.C D153.C SV6.15
R1: Q16.D ; also sheet 1,2,4
R2: Q30.D ; also sheet 1,2,4
S1: Q17.D ; also sheet 1,2,4
S2: Q31.D ; also sheet 1,2,4
T2: Q32.D ; also sheet 1,2,4
U1: Q18.D ; also sheet 1,2,4
U2: Q33.D ; also sheet 1,2,4
V1: Q19.D ; also sheet 1,2,4
V2: Q34.D ; also sheet 1,2,4

### Notes on the sheet
- Pull-downs could be BJT

## Sheet 4 of 4
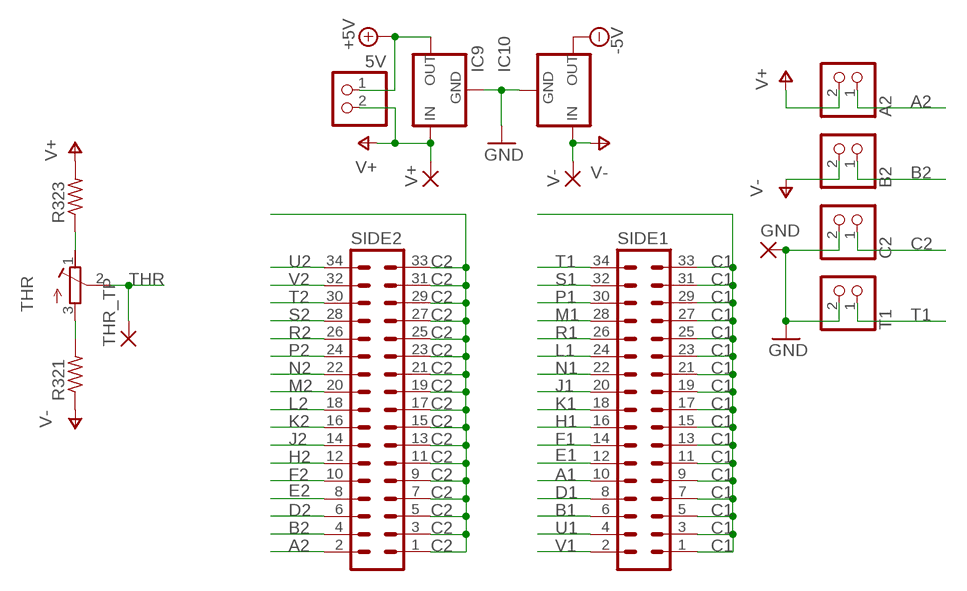
[diagram p3: schematic, sheet 4]

### Parts
5V  PINHD-1X2  [1X02]
A2  PINHD-1X2  [1X02]
B2  PINHD-1X2  [1X02]
C2  PINHD-1X2  [1X02]
GND  1,6/0,9  [1,6/0,9]
IC9  78XXL  [78XXL]
IC10  79XXL  [79XXL]
R321  R-US_0207/2V  [0207/2V]
R323  R-US_0207/2V  [0207/2V]
SIDE1  MA17-2  [MA17-2]
SIDE2  MA17-2  [MA17-2]
T1  PINHD-1X2  [1X02]
THR  R-TRIMMT18  [RTRIMT18]
THR_TP  1,6/0,9  [1,6/0,9]
V+  1,6/0,9  [1,6/0,9]
V-  1,6/0,9  [1,6/0,9]

### Nets
+5V: 5V.1 IC9.OUT ; also sheet 1
-5V: IC10.OUT ; also sheet 3
A1: SIDE1.10 ; also sheet 1,2,3
A2: A2.1 SIDE2.2
B1: SIDE1.6 ; also sheet 1,2,3
B2: B2.1 SIDE2.4
C1: SIDE1.1 SIDE1.3 SIDE1.5 SIDE1.7 SIDE1.9 SIDE1.11 SIDE1.13 SIDE1.15 SIDE1.17 SIDE1.19 SIDE1.21 SIDE1.23 SIDE1.25 SIDE1.27 SIDE1.29 SIDE1.31 SIDE1.33 ; also sheet 1,2,3
C2: C2.1 SIDE2.1 SIDE2.3 SIDE2.5 SIDE2.7 SIDE2.9 SIDE2.11 SIDE2.13 SIDE2.15 SIDE2.17 SIDE2.19 SIDE2.21 SIDE2.23 SIDE2.25 SIDE2.27 SIDE2.29 SIDE2.31 SIDE2.33
D1: SIDE1.8 ; also sheet 1,2,3
D2: SIDE2.6 ; also sheet 1,2,3
E1: SIDE1.12 ; also sheet 1,2,3
E2: SIDE2.8 ; also sheet 1,2,3
F1: SIDE1.14 ; also sheet 1,2,3
F2: SIDE2.10 ; also sheet 1,2,3
GND: C2.2 GND.1(P) IC9.GND IC10.GND T1.2 ; also sheet 1,2,3
H1: SIDE1.16 ; also sheet 1,2,3
H2: SIDE2.12 ; also sheet 1,2,3
J1: SIDE1.20 ; also sheet 1,2,3
J2: SIDE2.14 ; also sheet 1,2,3
K1: SIDE1.18 ; also sheet 1,2,3
K2: SIDE2.16 ; also sheet 1,2,3
L1: SIDE1.24 ; also sheet 1,2,3
L2: SIDE2.18 ; also sheet 1,2,3
M1: SIDE1.28 ; also sheet 1,2,3
M2: SIDE2.20 ; also sheet 1,2,3
N1: SIDE1.22 ; also sheet 1,2,3
N2: SIDE2.22 ; also sheet 1,2,3
N$2: R321.2 THR.3(A)
N$3: R323.1 THR.1(E)
P1: SIDE1.30 ; also sheet 1,2,3
P2: SIDE2.24 ; also sheet 1,2,3
R1: SIDE1.26 ; also sheet 1,2,3
R2: SIDE2.26 ; also sheet 1,2,3
S1: SIDE1.32 ; also sheet 1,2,3
S2: SIDE2.28 ; also sheet 1,2,3
T1: SIDE1.34 T1.1
T2: SIDE2.30 ; also sheet 1,2,3
THR: THR.2(S) THR_TP.1(P) ; also sheet 2
U1: SIDE1.4 ; also sheet 1,2,3
U2: SIDE2.34 ; also sheet 1,2,3
V1: SIDE1.2 ; also sheet 1,2,3
V2: SIDE2.32 ; also sheet 1,2,3
V+: 5V.2 A2.2 IC9.IN R323.2 V+.1(P) ; also sheet 2
V-: B2.2 IC10.IN R321.1 V-.1(P) ; also sheet 2

## Library data of the parts
5V A2 B2 C2 JP1 JP3-JP33 T1 = pinhead:PINHD-1X2: PIN HEADER
D1-D160 = diode:ZENER-DIODE: Z-Diode
GND THR_TP V+ V- = wirepad:1,6/0,9: THROUGH-HOLE PAD
IC1-IC8 = linear:LM339: Low Power Low Offset Voltage Quad Comparators with open collector; LM139/LM239/LM339/LM2901/LM3302
IC9 = v-reg:78XXL: VOLTAGE REGULATOR
IC10 = v-reg:79XXL: VOLTAGE REGULATOR
Q1 Q3-Q35 Q37 Q39 Q41 Q43 Q45 Q47 Q49 Q51 Q53 Q55 Q57 Q59 Q61 Q63 Q65 Q67 Q69 Q71 Q73 Q75 Q77 Q79 Q81 Q83 Q85 Q87 Q89 Q91 Q93 Q95 = transistor-small-signal:BS170: N-CHANNEL MOS FET
Q2 Q36 Q38 Q40 Q42 Q44 Q46 Q48 Q50 Q52 Q54 Q56 Q58 Q60 Q62 Q64 Q66 Q68 Q70 Q72 Q74 Q76 Q78 Q80 Q82 Q84 Q86 Q88 Q90 Q92 Q94 Q96 = transistor-small-signal:BS250: P-CHANNEL MOS FET
R1-R4 R6-R11 R13-R139 R141-R143 R145-R147 R149-R151 R153-R155 R157-R159 R161-R163 R165-R167 R169-R171 R173-R175 R177-R179 R181-R183 R185-R187 R189-R191 R193-R195 R197-R199 R201-R203 R205-R207 R209-R211 R213-R215 R217-R219 R221-R223 R225-R227 R229-R231 R233-R235 R237-R239 R241-R243 R245-R247 R249-R251 R253-R255 R257-R321 R323 = rcl:R-US_: RESISTOR, American symbol
SIDE1 SIDE2 = con-lstb:MA17-2: PIN HEADER; OC_FARNELL: unknown; OC_NEWARK: unknown
SV1-SV8 = con-lstb:MA08-2: PIN HEADER; OC_FARNELL: unknown; OC_NEWARK: unknown
THR = rcl:R-TRIMM: Trimm resistor